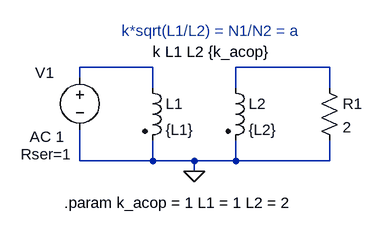
[diagram p0: schematic Draft2.asc]
Draft2.asc, the LTspice schematic file:
Version 4
SHEET 1 880 680
WIRE 112 96 0 96
WIRE 384 96 240 96
WIRE 0 112 0 96
WIRE 112 128 112 96
WIRE 240 128 240 96
WIRE 384 128 384 96
WIRE 0 240 0 192
WIRE 112 240 112 208
WIRE 112 240 0 240
WIRE 176 240 112 240
WIRE 240 240 240 208
WIRE 240 240 176 240
WIRE 384 240 384 208
WIRE 384 240 240 240
WIRE 176 256 176 240
FLAG 176 256 0
SYMBOL ind2 96 112 R0
SYMATTR InstName L1
SYMATTR Value {L1}
SYMATTR Type ind
SYMBOL ind2 224 112 R0
SYMATTR InstName L2
SYMATTR Value {L2}
SYMATTR Type ind
SYMBOL voltage 0 96 R0
WINDOW 0 -69 8 Left 2
WINDOW 123 -77 107 Left 2
WINDOW 39 -91 134 Left 2
SYMATTR InstName V1
SYMATTR Value ""
SYMATTR Value2 AC 1
SYMATTR SpiceLine Rser=1
SYMBOL res 368 112 R0
SYMATTR InstName R1
SYMATTR Value 2
TEXT 112 72 Left 2 !k L1 L2 {k_acop}
TEXT 64 40 Left 2 ;k*sqrt(L1/L2) = N1/N2 = a
TEXT -24 304 Left 2 !.param k_acop = 1 L1 = 1 L2 = 2

The netlist it stands for:
* Draft2.asc
L1 N001 0 {L1}
L2 N002 0 {L2}
V1 N001 0 AC 1 Rser=1
R1 N002 0 2
k L1 L2 {k_acop}
* k*sqrt(L1/L2) = N1/N2 = a
.param k_acop = 1 L1 = 1 L2 = 2
.backanno
.end